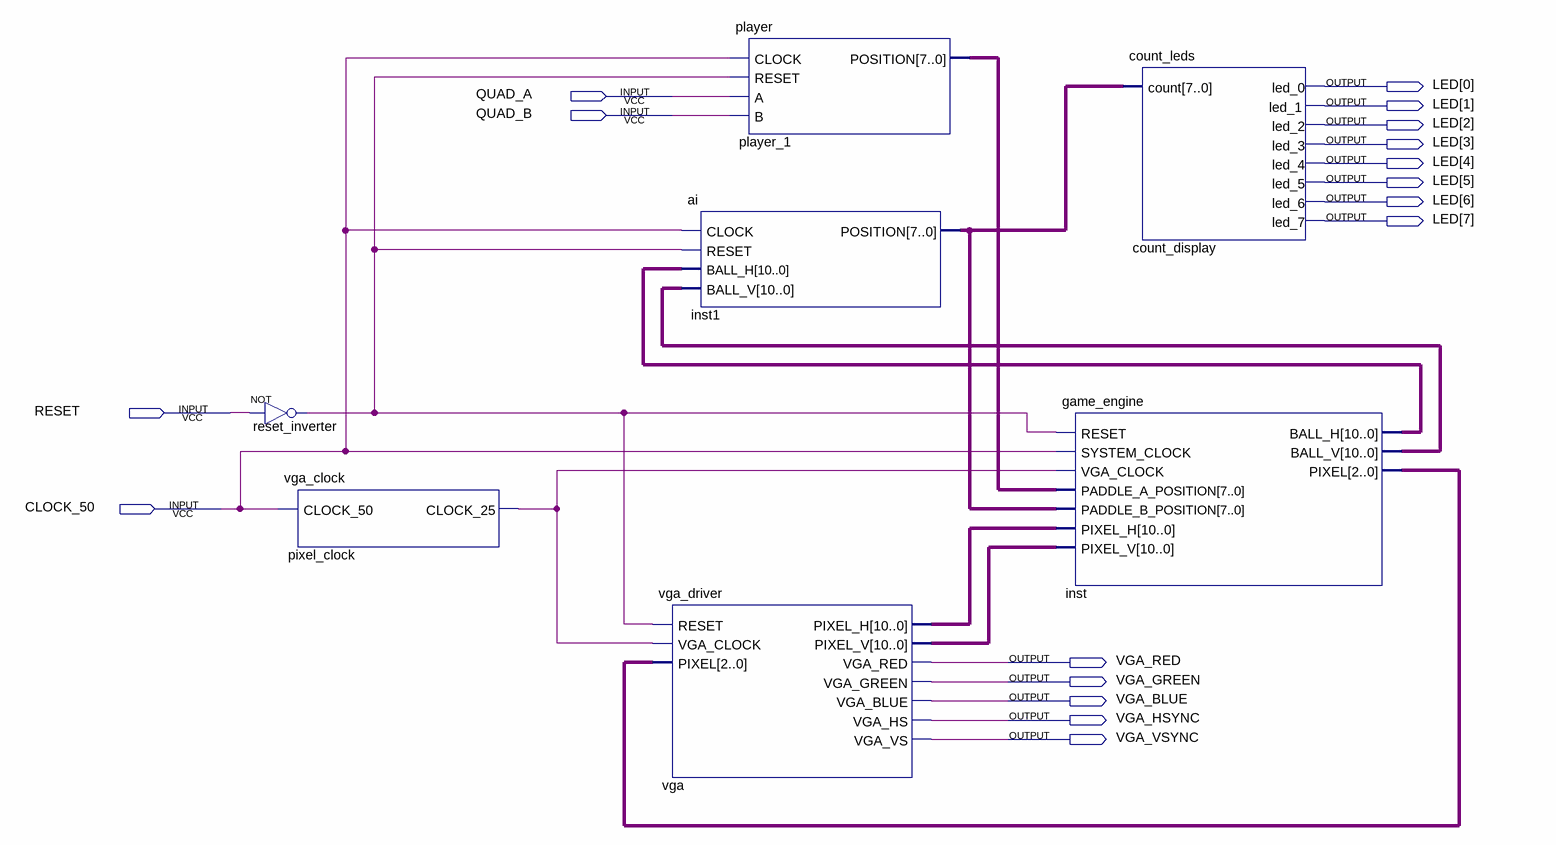
[diagram p0: schematic sheet]
// Quartus schematic pong.bdf as structural Verilog: 7 symbols, 17 pins
module pong (
  input  QUAD_A,
  input  QUAD_B,
  input  RESET,
  input  CLOCK_50,
  output [7:0] LED,
  output VGA_RED,
  output VGA_GREEN,
  output VGA_BLUE,
  output VGA_HSYNC,
  output VGA_VSYNC
);

  wire pixel_clock_clock_25, reset_inverter_out;
  wire [2:0] inst_pixel;
  wire [7:0] inst1_position, player_1_position;
  wire [10:0] inst_ball_h, inst_ball_v, vga_pixel_h, vga_pixel_v;

  not reset_inverter (reset_inverter_out, RESET);
  vga_clock pixel_clock (.CLOCK_50(CLOCK_50), .CLOCK_25(pixel_clock_clock_25));
  ai inst1 (
    .CLOCK(CLOCK_50), .RESET(reset_inverter_out), .BALL_H(inst_ball_h), .BALL_V(inst_ball_v),
    .POSITION(inst1_position));
  vga_driver vga (
    .RESET(reset_inverter_out), .VGA_CLOCK(pixel_clock_clock_25), .PIXEL(inst_pixel), .PIXEL_H(vga_pixel_h),
    .PIXEL_V(vga_pixel_v), .VGA_RED(VGA_RED), .VGA_GREEN(VGA_GREEN), .VGA_BLUE(VGA_BLUE), .VGA_HS(VGA_HSYNC),
    .VGA_VS(VGA_VSYNC));
  player player_1 (.CLOCK(CLOCK_50), .RESET(reset_inverter_out), .A(QUAD_A), .B(QUAD_B), .POSITION(player_1_position));
  game_engine inst (
    .RESET(reset_inverter_out), .SYSTEM_CLOCK(CLOCK_50), .VGA_CLOCK(pixel_clock_clock_25),
    .PADDLE_A_POSITION(player_1_position), .PADDLE_B_POSITION(inst1_position), .PIXEL_H(vga_pixel_h),
    .PIXEL_V(vga_pixel_v), .BALL_H(inst_ball_h), .BALL_V(inst_ball_v), .PIXEL(inst_pixel));
  count_leds count_display (
    .count(inst1_position), .led_0(LED[0]), .led_1(LED[1]), .led_2(LED[2]), .led_3(LED[3]), .led_4(LED[4]),
    .led_5(LED[5]), .led_6(LED[6]), .led_7(LED[7]));
endmodule
